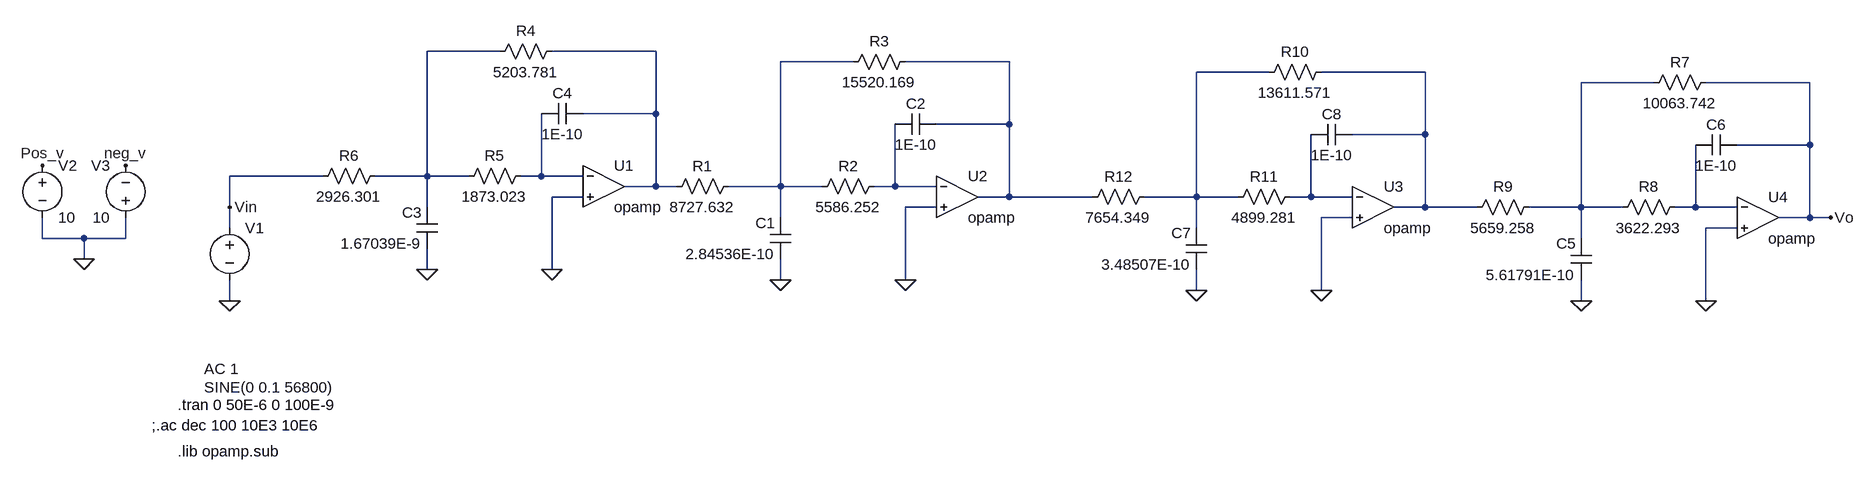
[diagram p0: schematic High order.asc]
High order.asc, the LTspice schematic file:
Version 4
SHEET 1 1892 756
WIRE -832 -128 -944 -128
WIRE -592 -128 -752 -128
WIRE -288 -112 -400 -112
WIRE -48 -112 -208 -112
WIRE 352 -96 240 -96
WIRE 592 -96 432 -96
WIRE 944 -80 832 -80
WIRE 1184 -80 1024 -80
WIRE -592 -32 -592 -128
WIRE -592 -32 -704 -32
WIRE -48 -16 -48 -112
WIRE -48 -16 -160 -16
WIRE 592 0 592 -96
WIRE 592 0 480 0
WIRE 1184 16 1184 -80
WIRE 1184 16 1072 16
WIRE -1104 64 -1248 64
WIRE -944 64 -944 -128
WIRE -944 64 -1024 64
WIRE -880 64 -944 64
WIRE -768 64 -768 -32
WIRE -768 64 -800 64
WIRE -704 64 -768 64
WIRE -592 80 -592 -32
WIRE -592 80 -640 80
WIRE -560 80 -592 80
WIRE -400 80 -400 -112
WIRE -400 80 -480 80
WIRE -336 80 -400 80
WIRE -224 80 -224 -16
WIRE -224 80 -256 80
WIRE -160 80 -224 80
WIRE -704 96 -752 96
WIRE -48 96 -48 -16
WIRE -48 96 -96 96
WIRE 80 96 -48 96
WIRE 240 96 240 -96
WIRE 240 96 160 96
WIRE 304 96 240 96
WIRE 416 96 416 0
WIRE 416 96 384 96
WIRE 480 96 416 96
WIRE -1248 112 -1248 64
WIRE -944 112 -944 64
WIRE -160 112 -208 112
WIRE 592 112 592 0
WIRE 592 112 544 112
WIRE 672 112 592 112
WIRE 832 112 832 -80
WIRE 832 112 752 112
WIRE 896 112 832 112
WIRE 1008 112 1008 16
WIRE 1008 112 976 112
WIRE 1072 112 1008 112
WIRE -400 128 -400 80
WIRE 480 128 432 128
WIRE 1184 128 1184 16
WIRE 1184 128 1136 128
WIRE 1216 128 1184 128
WIRE -1248 144 -1248 112
WIRE 240 144 240 96
WIRE 1072 144 1024 144
WIRE -1536 160 -1536 128
WIRE -1472 160 -1536 160
WIRE -1408 160 -1408 128
WIRE -1408 160 -1472 160
WIRE 832 160 832 112
WIRE -1472 192 -1472 160
WIRE -944 208 -944 176
WIRE -752 208 -752 96
WIRE -400 224 -400 192
WIRE -208 224 -208 112
WIRE 240 240 240 208
WIRE 432 240 432 128
WIRE -1248 256 -1248 224
WIRE 832 256 832 224
WIRE 1024 256 1024 144
FLAG -208 224 0
FLAG -400 224 0
FLAG -1248 256 0
FLAG -1536 48 Pos_v
FLAG -1408 48 neg_v
FLAG -1472 192 0
FLAG 1216 128 Vo
FLAG -1248 112 Vin
FLAG -752 208 0
FLAG -944 208 0
FLAG 1024 256 0
FLAG 832 256 0
FLAG 432 240 0
FLAG 240 240 0
SYMBOL res -192 -128 R90
WINDOW 0 0 56 VBottom 2
WINDOW 3 32 56 VTop 2
SYMATTR InstName R3
SYMATTR Value 15520.169
SYMBOL res -240 64 R90
WINDOW 0 0 56 VBottom 2
WINDOW 3 32 56 VTop 2
SYMATTR InstName R2
SYMATTR Value 5586.252
SYMBOL res -464 64 R90
WINDOW 0 0 56 VBottom 2
WINDOW 3 32 56 VTop 2
SYMATTR InstName R1
SYMATTR Value 8727.632
SYMBOL cap -384 192 R180
WINDOW 0 24 56 Left 2
WINDOW 3 24 8 Left 2
SYMATTR InstName C1
SYMATTR Value 2.84536E-10
SYMBOL cap -224 0 R270
WINDOW 0 32 32 VTop 2
WINDOW 3 0 32 VBottom 2
SYMATTR InstName C2
SYMATTR Value 1E-10
SYMBOL voltage -1248 128 R0
WINDOW 123 -39 233 Left 2
WINDOW 39 0 0 Left 0
WINDOW 3 -39 261 Left 2
SYMATTR Value2 AC 1
SYMATTR Value SINE(0 0.1 56800)
SYMATTR InstName V1
SYMBOL voltage -1536 32 R0
SYMATTR InstName V2
SYMATTR Value 10
SYMBOL voltage -1408 144 R180
WINDOW 0 24 96 Left 2
WINDOW 3 24 16 Left 2
SYMATTR InstName V3
SYMATTR Value 10
SYMBOL res -736 -144 R90
WINDOW 0 0 56 VBottom 2
WINDOW 3 32 56 VTop 2
SYMATTR InstName R4
SYMATTR Value 5203.781
SYMBOL res -784 48 R90
WINDOW 0 0 56 VBottom 2
WINDOW 3 32 56 VTop 2
SYMATTR InstName R5
SYMATTR Value 1873.023
SYMBOL res -1008 48 R90
WINDOW 0 0 56 VBottom 2
WINDOW 3 32 56 VTop 2
SYMATTR InstName R6
SYMATTR Value 2926.301
SYMBOL cap -928 176 R180
WINDOW 0 24 56 Left 2
WINDOW 3 24 8 Left 2
SYMATTR InstName C3
SYMATTR Value 1.67039E-9
SYMBOL cap -768 -16 R270
WINDOW 0 32 32 VTop 2
WINDOW 3 0 32 VBottom 2
SYMATTR InstName C4
SYMATTR Value 1E-10
SYMBOL res 1040 -96 R90
WINDOW 0 0 56 VBottom 2
WINDOW 3 32 56 VTop 2
SYMATTR InstName R7
SYMATTR Value 10063.742
SYMBOL res 992 96 R90
WINDOW 0 0 56 VBottom 2
WINDOW 3 32 56 VTop 2
SYMATTR InstName R8
SYMATTR Value 3622.293
SYMBOL res 768 96 R90
WINDOW 0 0 56 VBottom 2
WINDOW 3 32 56 VTop 2
SYMATTR InstName R9
SYMATTR Value 5659.258
SYMBOL cap 848 224 R180
WINDOW 0 24 56 Left 2
WINDOW 3 24 8 Left 2
SYMATTR InstName C5
SYMATTR Value 5.61791E-10
SYMBOL cap 1008 32 R270
WINDOW 0 32 32 VTop 2
WINDOW 3 0 32 VBottom 2
SYMATTR InstName C6
SYMATTR Value 1E-10
SYMBOL res 448 -112 R90
WINDOW 0 0 56 VBottom 2
WINDOW 3 32 56 VTop 2
SYMATTR InstName R10
SYMATTR Value 13611.571
SYMBOL res 400 80 R90
WINDOW 0 0 56 VBottom 2
WINDOW 3 32 56 VTop 2
SYMATTR InstName R11
SYMATTR Value 4899.281
SYMBOL res 176 80 R90
WINDOW 0 0 56 VBottom 2
WINDOW 3 32 56 VTop 2
SYMATTR InstName R12
SYMATTR Value 7654.349
SYMBOL cap 256 208 R180
WINDOW 0 24 56 Left 2
WINDOW 3 24 8 Left 2
SYMATTR InstName C7
SYMATTR Value 3.48507E-10
SYMBOL cap 416 16 R270
WINDOW 0 32 32 VTop 2
WINDOW 3 0 32 VBottom 2
SYMATTR InstName C8
SYMATTR Value 1E-10
SYMBOL Opamps\\opamp -672 16 R0
SYMATTR InstName U1
SYMBOL Opamps\\opamp -128 32 R0
SYMATTR InstName U2
SYMBOL Opamps\\opamp 512 48 R0
SYMATTR InstName U3
SYMBOL Opamps\\opamp 1104 64 R0
SYMATTR InstName U4
TEXT -1368 448 Left 2 !;.ac dec 100 10E3 10E6
TEXT -1328 416 Left 2 !.tran 0 50E-6 0 100E-9
TEXT -1328 488 Left 2 !.lib opamp.sub

The netlist it stands for:
* High order.asc
R3 N004 N003 15520.169
R2 N009 N003 5586.252
R1 N003 N002 8727.632
C1 0 N003 2.84536E-10
C2 N009 N004 1E-10
V1 Vin 0 SINE(0 0.1 56800) AC 1
V2 Pos_v 0 10
V3 0 neg_v 10
R4 N002 N001 5203.781
R5 N008 N001 1873.023
R6 N001 Vin 2926.301
C3 0 N001 1.67039E-9
C4 N008 N002 1E-10
R7 Vo N007 10063.742
R8 N011 N007 3622.293
R9 N007 N006 5659.258
C5 0 N007 5.61791E-10
C6 N011 Vo 1E-10
R10 N006 N005 13611.571
R11 N010 N005 4899.281
R12 N005 N004 7654.349
C7 0 N005 3.48507E-10
C8 N010 N006 1E-10
XU1 N008 0 N002 opamp Aol=100K GBW=10Meg  ; pins invin noninvin out
XU2 N009 0 N004 opamp Aol=100K GBW=10Meg  ; pins invin noninvin out
XU3 N010 0 N006 opamp Aol=100K GBW=10Meg  ; pins invin noninvin out
XU4 N011 0 Vo opamp Aol=100K GBW=10Meg  ; pins invin noninvin out
;.ac dec 100 10E3 10E6
.tran 0 50E-6 0 100E-9
.lib opamp.sub
.backanno
.end

* Results of the author's LTspice run, read from the files saved beside the schematic
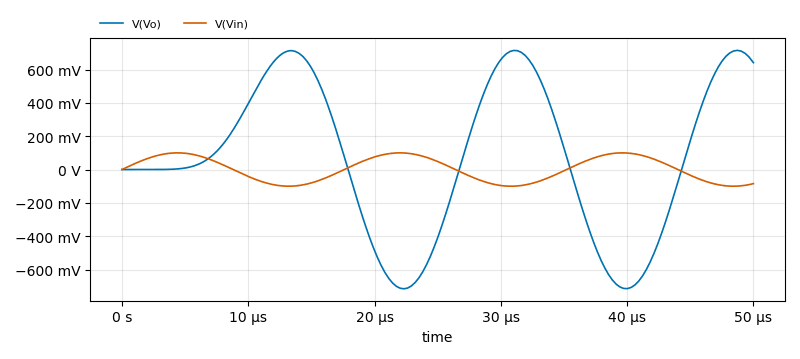
[diagram p1: Transient Analysis of High order.asc, plotted from the saved traces]
* Transient Analysis, 1 run:
*   V(Vo): min -715.4 mV, max 714.9 mV, average 73.76 mV, rms 470.1 mV, last 641 mV
*   V(Vin): min -100 mV, max 100 mV, average 2.604 mV, rms 71.6 mV, last -84.43 mV